# Altium schematic sheet 在线升级仪_定制转接板V1.1_20231208 (1).SchDoc
size A3
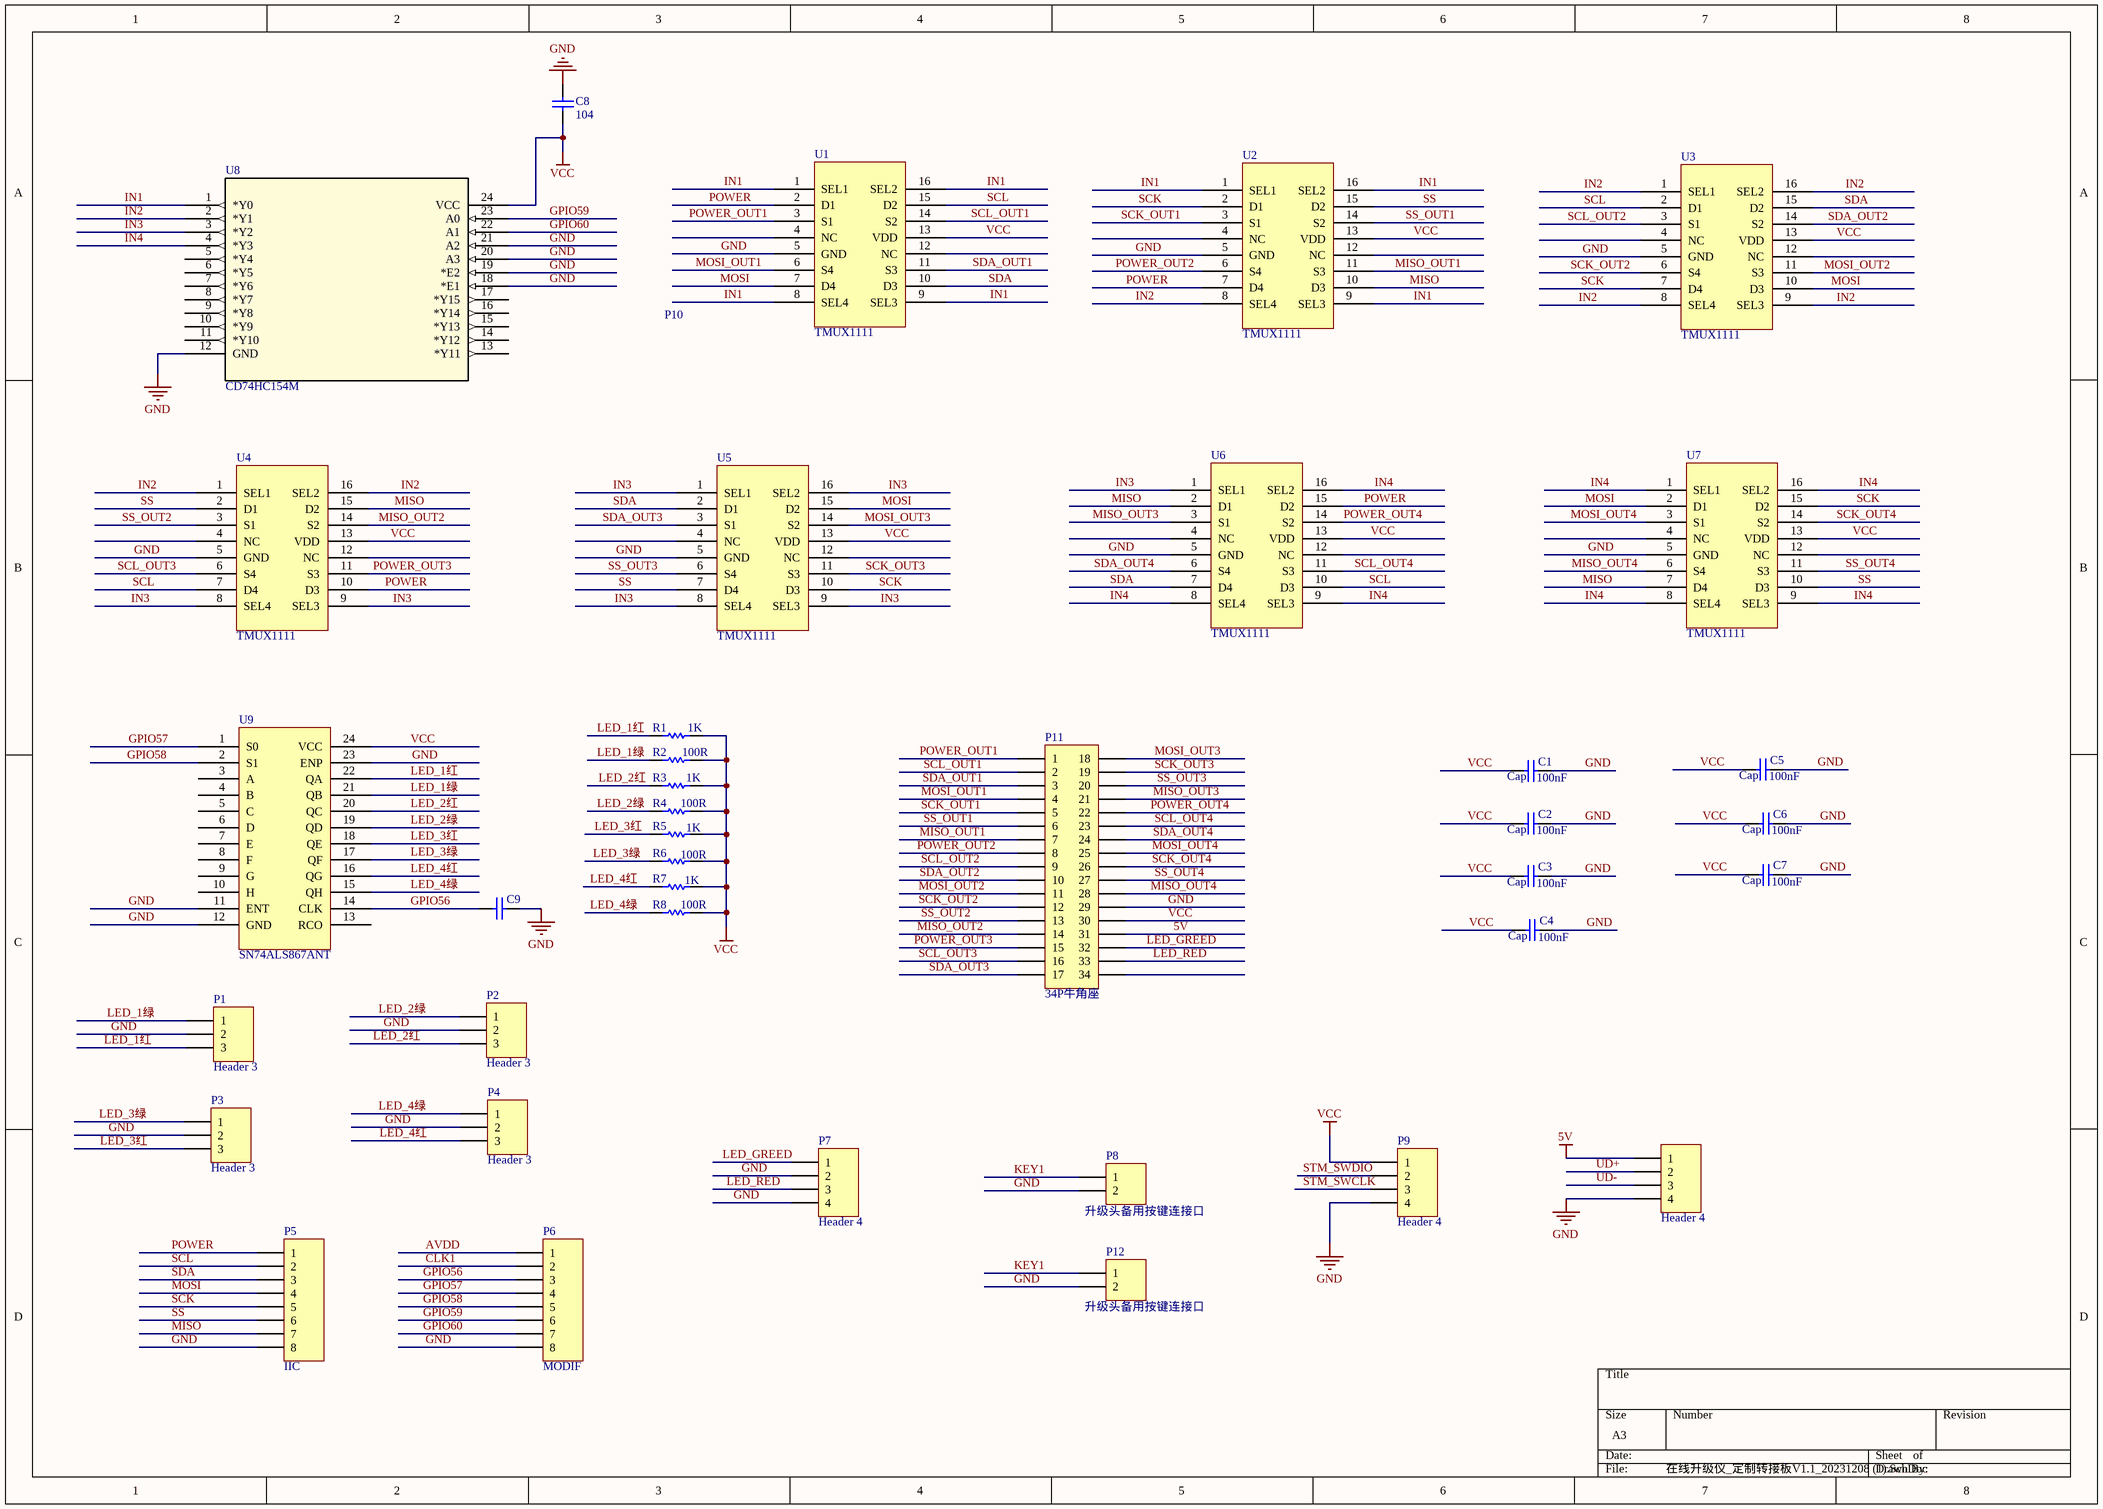
[diagram p0: 在线升级仪_定制转接板V1.1_20231208 (1).SchDoc]

## Parts
C1  Cap  value 100nF  [0603]
C2  Cap  value 100nF  [0603]
C3  Cap  value 100nF  [0603]
C4  Cap  value 100nF  [0603]
C5  Cap  value 100nF  [0603]
C6  Cap  value 100nF  [0603]
C7  Cap  value 100nF  [0603]
C8  value 104  [0603]  (hidden comment: Cap Semi)
C9  Cap Semi  [0603]  (value not drawn)
P1  Header 3  [HDR1X3]
P2  Header 3  [HDR1X3]
P3  Header 3  [HDR1X3]
P4  Header 3  [HDR1X3]
P5  IIC  [RJ45网络插座]
P6  MODIF  [RJ45网络插座]
P7  Header 4  [4pin_1.25mm]
P8  升级头备用按键连接口  [2P座子]
P9  Header 4  [4P座子]
P10  Header 4  [4P座子]
P11  34P牛角座  [34P 牛角座]
P12  升级头备用按键连接口  [2P座子]
R1  value 1K  [0603]  (hidden comment: Res1)
R2  value 100R  [0603]  (hidden comment: Res1)
R3  value 1K  [0603]  (hidden comment: Res1)
R4  value 100R  [0603]  (hidden comment: Res1)
R5  value 1K  [0603]  (hidden comment: Res1)
R6  value 100R  [0603]  (hidden comment: Res1)
R7  value 1K  [0603]  (hidden comment: Res1)
R8  value 100R  [0603]  (hidden comment: Res1)
U1  TMUX1111  [TMUX1111]
U2  TMUX1111  [TMUX1111]
U3  TMUX1111  [TMUX1111]
U4  TMUX1111  [TMUX1111]
U5  TMUX1111  [TMUX1111]
U6  TMUX1111  [TMUX1111]
U7  TMUX1111  [TMUX1111]
U8  CD74HC154M  [CD74HC154M]
U9  SN74ALS867ANT  [SN74ALS867ANT]

## Nets
5V: P10.1 P11.31
GND: C1.2 C2.2 C3.2 C4.2 C5.2 C6.2 C7.2 C8.1 C9.1 P1.2 P2.2 P3.2 P4.2 P5.8 P6.8 P7.2 P7.4 P8.2 P9.4 P10.4 P11.29 P12.2 U1.5(GND) U2.5(GND) U3.5(GND) U4.5(GND) U5.5(GND) U6.5(GND) U7.5(GND) U8.12(GND) U8.18(*E1) U8.19(*E2) U8.20(A3) U8.21(A2) U9.11(ENT) U9.12(GND) U9.23(ENP)
VCC: C1.1 C2.1 C3.1 C4.1 C5.1 C6.1 C7.1 C8.2 P9.1 P11.30 R1.1 R2.1 R3.1 R4.1 R5.1 R6.1 R7.1 R8.1 U1.13(VDD) U2.13(VDD) U3.13(VDD) U4.13(VDD) U5.13(VDD) U6.13(VDD) U7.13(VDD) U8.24(VCC) U9.24(VCC)
AVDD: P6.1
CLK1: P6.2
GPIO56: C9.2 P6.3 U9.14(CLK)
GPIO57: P6.4 U9.1(S0)
GPIO58: P6.5 U9.2(S1)
GPIO59: P6.6 U8.23(A0)
GPIO60: P6.7 U8.22(A1)
IN1: U1.1(SEL1) U1.8(SEL4) U1.9(SEL3) U1.16(SEL2) U2.1(SEL1) U2.9(SEL3) U2.16(SEL2) U8.1(*Y0)
IN2: U2.8(SEL4) U3.1(SEL1) U3.8(SEL4) U3.9(SEL3) U3.16(SEL2) U4.1(SEL1) U4.16(SEL2) U8.2(*Y1)
IN3: U4.8(SEL4) U4.9(SEL3) U5.1(SEL1) U5.8(SEL4) U5.9(SEL3) U5.16(SEL2) U6.1(SEL1) U8.3(*Y2)
IN4: U6.8(SEL4) U6.9(SEL3) U6.16(SEL2) U7.1(SEL1) U7.8(SEL4) U7.9(SEL3) U7.16(SEL2) U8.4(*Y3)
KEY1: P8.1 P12.1
LED_1红: P1.3 R1.2 U9.22(QA)
LED_1绿: P1.1 R2.2 U9.21(QB)
LED_2红: P2.3 R3.2 U9.20(QC)
LED_2绿: P2.1 R4.2 U9.19(QD)
LED_3红: P3.3 R5.2 U9.18(QE)
LED_3绿: P3.1 R6.2 U9.17(QF)
LED_4红: P4.3 R7.2 U9.16(QG)
LED_4绿: P4.1 R8.2 U9.15(QH)
LED_GREED: P7.1 P11.32
LED_RED: P7.3 P11.33
MISO: P5.7 U2.10(D3) U4.15(D2) U6.2(D1) U7.7(D4)
MISO_OUT1: P11.7 U2.11(S3)
MISO_OUT2: P11.14 U4.14(S2)
MISO_OUT3: P11.21 U6.3(S1)
MISO_OUT4: P11.28 U7.6(S4)
MOSI: P5.4 U1.7(D4) U3.10(D3) U5.15(D2) U7.2(D1)
MOSI_OUT1: P11.4 U1.6(S4)
MOSI_OUT2: P11.11 U3.11(S3)
MOSI_OUT3: P11.18 U5.14(S2)
MOSI_OUT4: P11.25 U7.3(S1)
POWER: P5.1 U1.2(D1) U2.7(D4) U4.10(D3) U6.15(D2)
POWER_OUT1: P11.1 U1.3(S1)
POWER_OUT2: P11.8 U2.6(S4)
POWER_OUT3: P11.15 U4.11(S3)
POWER_OUT4: P11.22 U6.14(S2)
SCK: P5.5 U2.2(D1) U3.7(D4) U5.10(D3) U7.15(D2)
SCK_OUT1: P11.5 U2.3(S1)
SCK_OUT2: P11.12 U3.6(S4)
SCK_OUT3: P11.19 U5.11(S3)
SCK_OUT4: P11.26 U7.14(S2)
SCL: P5.2 U1.15(D2) U3.2(D1) U4.7(D4) U6.10(D3)
SCL_OUT1: P11.2 U1.14(S2)
SCL_OUT2: P11.9 U3.3(S1)
SCL_OUT3: P11.16 U4.6(S4)
SCL_OUT4: P11.23 U6.11(S3)
SDA: P5.3 U1.10(D3) U3.15(D2) U5.2(D1) U6.7(D4)
SDA_OUT1: P11.3 U1.11(S3)
SDA_OUT2: P11.10 U3.14(S2)
SDA_OUT3: P11.17 U5.3(S1)
SDA_OUT4: P11.24 U6.6(S4)
SS: P5.6 U2.15(D2) U4.2(D1) U5.7(D4) U7.10(D3)
SS_OUT1: P11.6 U2.14(S2)
SS_OUT2: P11.13 U4.3(S1)
SS_OUT3: P11.20 U5.6(S4)
SS_OUT4: P11.27 U7.11(S3)
STM_SWCLK: P9.3
STM_SWDIO: P9.2
UD+: P10.2
UD-: P10.3

Not connected (* = marked no-connect by the designer): P11 34; U1 4(NC) 12(NC); U2 4(NC) 12(NC); U3 4(NC) 12(NC); U4 4(NC) 12(NC); U5 4(NC) 12(NC); U6 4(NC) 12(NC); U7 4(NC) 12(NC); U8 5(*Y4) 6(*Y5) 7(*Y6) 8(*Y7) 9(*Y8) 10(*Y9) 11(*Y10) 13(*Y11) 14(*Y12) 15(*Y13) 16(*Y14) 17(*Y15); U9 3(A) 4(B) 5(C) 6(D) 7(E) 8(F) 9(G) 10(H) 13(RCO)

## Library data of the parts
C1-C7 = Cap: Capacitor; Published: 8-Jun-2000; LatestRevisionDate: 17-Jul-2002; LatestRevisionNote: Re-released for DXP Platform.; PackageReference: RAD-0.3; Publisher: Altium Limited
C8 C9 = Cap Semi: Capacitor (Semiconductor SIM Model); Published: 8-Jun-2000; LatestRevisionDate: 29-May-2009; LatestRevisionNote: IPC-7351 Footprint Added.; PackageReference: C1206; Publisher: Altium Limited; PackageDescription: Chip Capacitor
P1-P4 = Header 3: Header, 3-Pin; LatestRevisionDate: 17-Jul-2002; LatestRevisionNote: Re-released for DXP Platform.; Publisher: Altium Limited
P5 P6 = Header 8: Header, 8-Pin; LatestRevisionDate: 17-Jul-2002; LatestRevisionNote: Re-released for DXP Platform.; Publisher: Altium Limited
P7 P9 P10 = Header 4: Header, 4-Pin; LatestRevisionDate: 17-Jul-2002; LatestRevisionNote: Re-released for DXP Platform.; Publisher: Altium Limited
P8 P12 = Header 2: Header, 2-Pin; LatestRevisionDate: 17-Jul-2002; LatestRevisionNote: Re-released for DXP Platform.; Publisher: Altium Limited
P11 = Header 17X2A: Header, 17-Pin, Dual row; LatestRevisionDate: 17-Jul-2002; LatestRevisionNote: Re-released for DXP Platform.; Publisher: Altium Limited
R1-R8 = Res1: Resistor; Published: 8-Jun-2000; LatestRevisionDate: 17-Jul-2002; LatestRevisionNote: Re-released for DXP Platform.; PackageReference: AXIAL-0.3; Publisher: Altium Limited; PackageDescription: Axial Device, Thru-Hole; 2 Leads; 0.3 in Pin Spacing
U1-U7 = Component_3
U8 = CD74HC154M: High Speed CMOS Logic 4-to-16 Line Decoder/Demultiplexer; Manufacturer: Texas Instruments; INDUSTRY_STD_PKG_TYPE: SOIC; PIN_COUNT: 24; PACKAGE_DESIGNATOR: DW; Datasheet_URL: http://www.ti.com/lit/gpn/CD74HC154; FAMILY_NAME: DECODER/DEMULTIPLEXER; GENERIC_PART_NUMBER: CD74HC154; Copyright: Copyright (C) 2018 Accelerated Designs. All rights reserved; RefDes: RefDes; Type: DEV
U9 = Component_2